# EAGLE design v1sch (EAGLE 6.4)
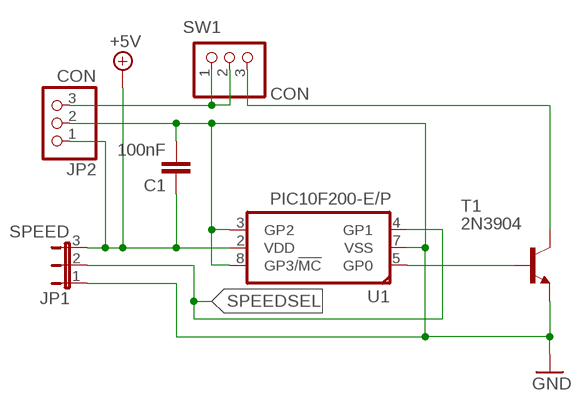
[diagram p0: schematic, sheet 1]

## Parts
C1  100nF  C-EU025-025X050  [C025-025X050]
JP1  SPEED  JP2E  [JP2]
JP2  CON  PINHD-1X3  [1X03]
SW1  CON  PINHD-1X3  [1X03]
T1  2N3904  [TO92]
U1  PIC10F200-E/P  PIC10F200P  [DIL08]

## Nets
+5V: C1.1 JP1.3 JP2.1 U1.2(VDD)
GND: C1.2 JP1.1 JP2.2 T1.3(E) U1.3(GP2) U1.7(VSS) U1.8(GP3/!MC!)
N$1: SW1.3 T1.1(C)
N$2: JP2.3 SW1.1 SW1.2
N$4: T1.2(B) U1.5(GP0)
SPEEDSEL: JP1.2 U1.4(GP1)

## Library data of the parts
C1 = rcl:C-EU: CAPACITOR, European symbol; OC_FARNELL: unknown
JP1 = jumper:JP2E: JUMPER
JP2 SW1 = adafruit:PINHD-1X3: PIN HEADER
T1 = transistor:2N3904: NPN TRANSISTOR; MF: MULTICOMP; MPN: 2N3904; OC_FARNELL: 1574370
U1 = microchip_pic10f:PIC10F200: Low pincount microcontroller http://www.microchip.com/wwwproducts/Devices.aspx?product=PIC10F200 Properties Parameter Name Value Program Memory Type Flash Program Memory (KB) 0.375 CPU Speed (MIPS) 1 RAM Bytes 16 Timers 1 x 8-bit Temperature Range (C) -40 to 125 Operating Voltage Range (V) 2 to 5.5 Pin Count 6 Features Available in either SOT-23 or 2x3 DFN packaging Precision 4 MHz internal oscillator Baseline Core with 33 Instructions, 2 Stack Levels All single-cycle Instructions except for program branches which are two cycles 12-bit wide instructions 8-bit wide data path 25 mA source/sink current I/O Low power (100nA) sleep current One 8-bit timer (TMR0) Watchdog timer (WDT) In Circuit Serial Programming™ (ICSP™) capability In-Circuit debugging support Programmable code protection Library from www.mikroelektroniikka.fi/lbr; OC_FARNELL: unknown

## Net classes
0 default: clearance 0.355 mm

## Board
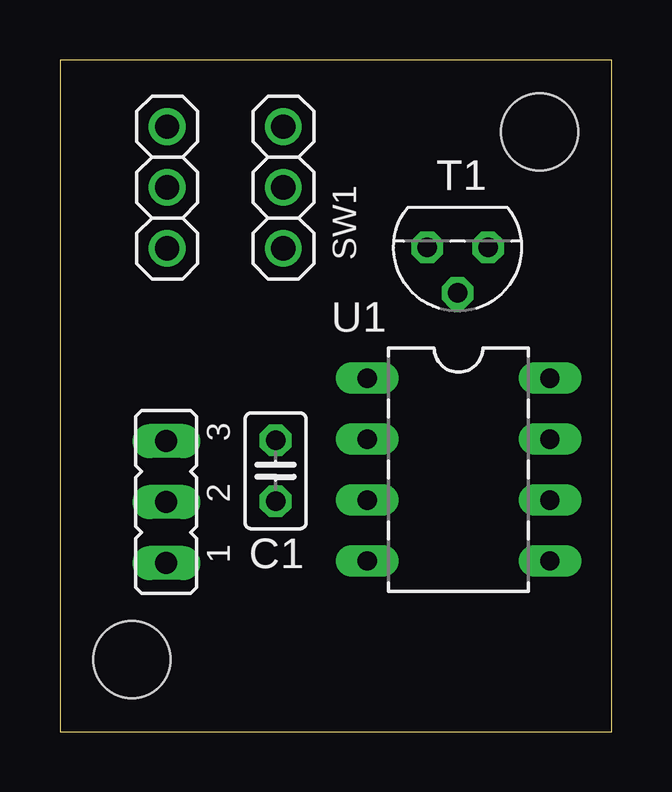
[diagram p1: board, top side]
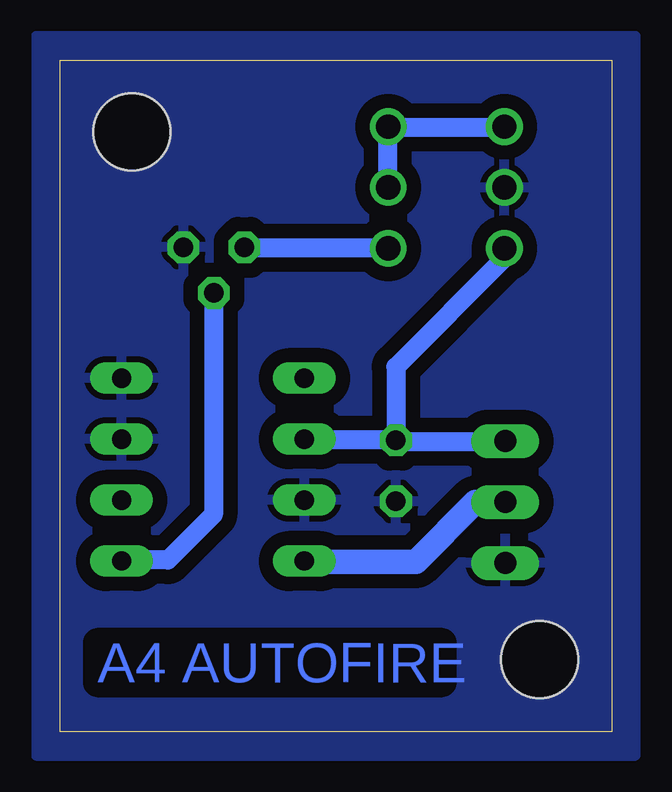
[diagram p2: board, bottom side, seen from below]

Size 23 x 28 mm. Coordinates in mm from the lower left corner, seen from the top.
Outline: 0,0 23,0 23,28 0,28 0,0
Copper layers (1*16): Top 0.035mm / dielectric 2mm / Bottom 0.035mm
Design rules "a4fire *": minimum track width 0.8mm, minimum drill 24mil, track to track 0.6mm, track to pad 0.6mm, pad to pad 0.6mm, via to via 20mil, smd to smd 20mil, copper to edge 0mil, drill to drill 8mil, minimum pad ring 10mil, minimum via ring 8mil, stop-mask expansion 4mil, vias tented up to drill 0mil, thermal gap 10mil
Holes 3.2 mm at 3,3 20,25

### Footprints (pad centres in the part's own frame; a part is rotated, then mirrored left to right if it is on the bottom)
C025-025X050 = drill 0.813 octagon: 1 -1.27,0; 2 1.27,0
JP2 = drill 0.914 long: 1 -2.54,0; 2 0,0; 3 2.54,0
1X03 = drill 1.016: 1 -2.54,0; 2 0,0; 3 2.54,0
TO92 = drill 0.813 octagon: 1 1.27,0; 2 0,1.905; 3 -1.27,0
DIL08 = drill 0.8 pad 1.3 long: 1 -3.81,-3.81; 2 -1.27,-3.81; 3 1.27,-3.81; 4 3.81,-3.81; 5 3.81,3.81; 6 1.27,3.81; 7 -1.27,3.81; 8 -3.81,3.81

### Placement (x,y rotation side)
C1  8.99,10.87 270 top
JP1  4.43,9.57 90 top
JP2  4.47,22.68 90 top
SW1  9.32,22.68 270 top
T1  16.58,20.19 180 top
U1  16.62,10.92 270 top

### Tracks (layer width: path | path; a pad name or v marks a point on that pad's centre or on a via)
+5V
  Bottom 0.8: C1.1 12.8,12.15 U1.2 | JP1.3 4.45,12.1 8.6,12.1 C1.1 | JP2.1 4.47,19.73 9,15.2 C1.1
GND
  pour Bottom: -1,29 24,29 24,-1 -1,-1
N$1
  Bottom 0.8: T1.1 15.3,20.15 9.35,20.15 SW1.3
N$2
  Bottom 0.8: JP2.3 4.5,25.2 9.3,25.2 SW1.1 SW1.2
N$4
  Bottom 0.8: U1.5 20.4,7.15 18.5,7.15 16.6,9.05 16.6,18.25 T1.2
SPEEDSEL
  Bottom 1.016: JP1.2 5.67,9.57 8.16,7.08 12.78,7.08 U1.4

### Text on the board
Bottom: A4 AUTOFIRE
tValues: FO | FI | G | +5 | SPEED SELECT / 1-2 NORMAL / 2-3 TURBO